# Altium schematic sheet CV060_CPU.SchDoc: CV060 HVAC Controller
size A3; Author: PPavlov; DrawnBy: PPavlov; Engineer: PPavlov; Organization: Celse; DocumentNumber: 1; Revision: 1; SheetNumber: 1; SheetTotal: 3
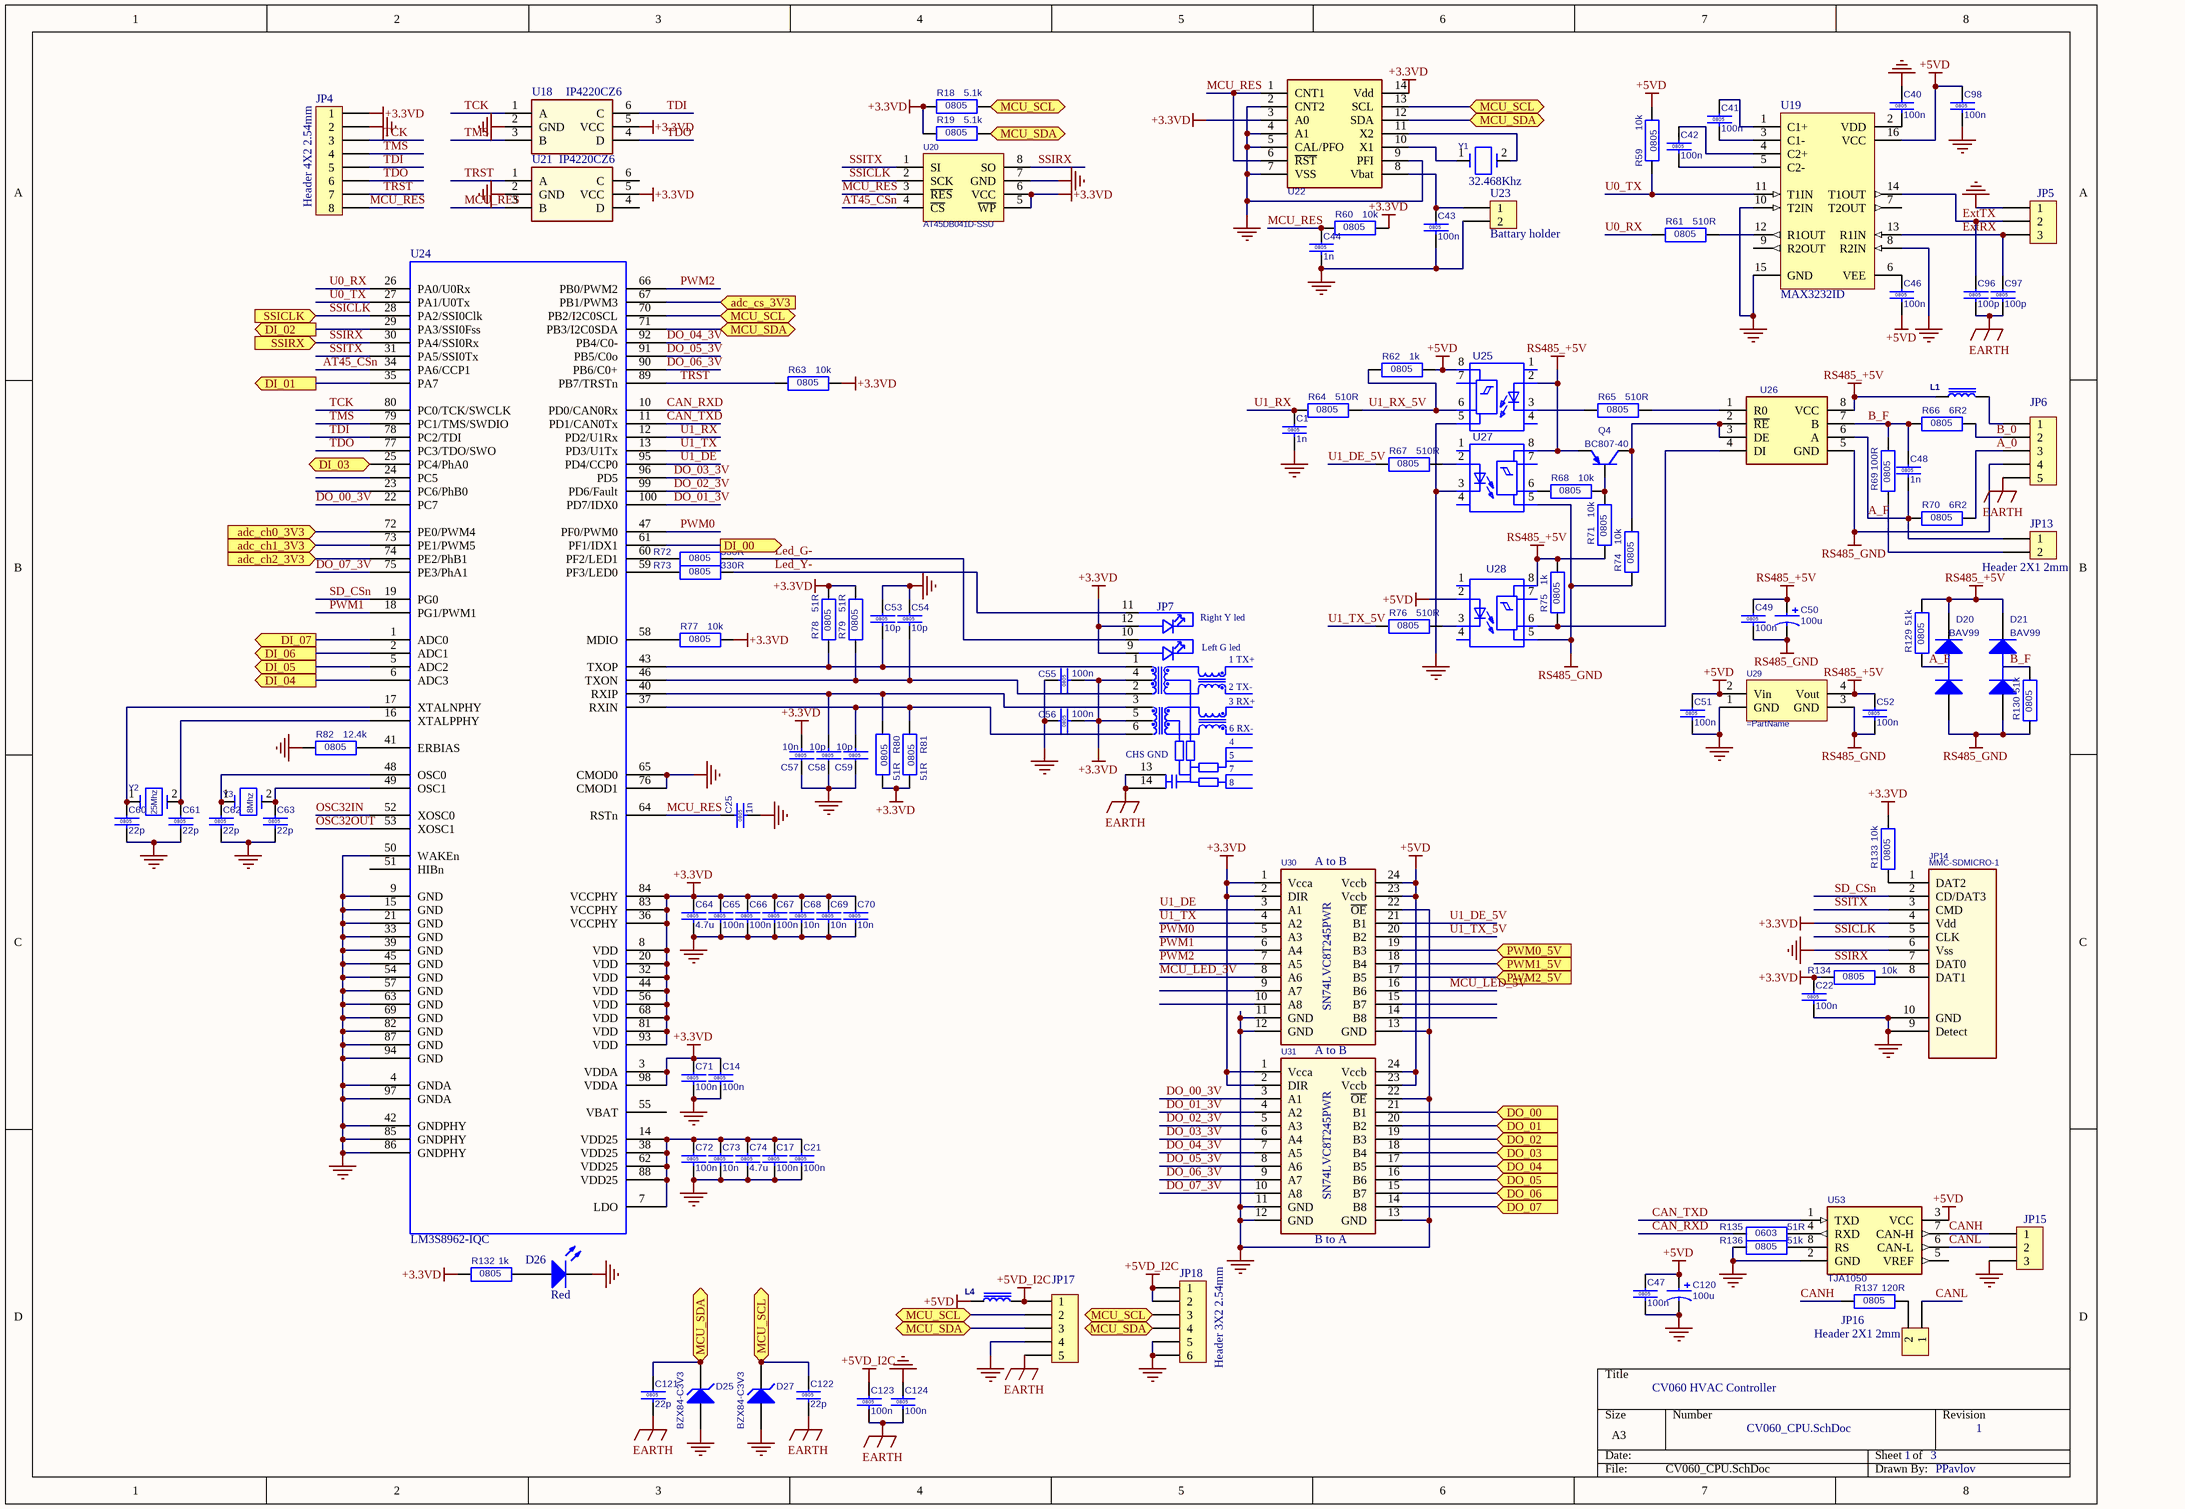
[diagram p0: CV060_CPU.SchDoc]

## Parts
C1  Case: 0805  [RC0805]  (hidden comment: 1n)
C14  Case: 0805  [RC0805]  (hidden comment: 100n)
C17  Case: 0805  [RC0805]  (hidden comment: 100n)
C21  Case: 0805  [RC0805]  (hidden comment: 100n)
C22  Case: 0805  [RC0805]  (hidden comment: 100n)
C25  Case: 0805  [RC0805]  (hidden comment: 1n)
C40  Case: 0805  [RC0805]  (hidden comment: 100n)
C41  Case: 0805  [RC0805]  (hidden comment: 100n)
C42  Case: 0805  [RC0805]  (hidden comment: 100n)
C43  Case: 0805  [RC0805]  (hidden comment: 100n)
C44  Case: 0805  [RC0805]  (hidden comment: 1n)
C46  Case: 0805  [RC0805]  (hidden comment: 100n)
C47  Case: 0805  [RC0805]  (hidden comment: 100n)
C48  Case: 0805  [RC0805]  (hidden comment: 1n)
C49  Case: 0805  [RC0805]  (hidden comment: 100n)
C50  100u  [CEH12.5D5P2.5]
C51  Case: 0805  [RC0805]  (hidden comment: 100n)
C52  Case: 0805  [RC0805]  (hidden comment: 100n)
C53  Case: 0805  [RC0805]  (hidden comment: 10p)
C54  Case: 0805  [RC0805]  (hidden comment: 10p)
C55  Case: 0805  [RC0805]  (hidden comment: 100n)
C56  Case: 0805  [RC0805]  (hidden comment: 100n)
C57  Case: 0805  [RC0805]  (hidden comment: 10n)
C58  Case: 0805  [RC0805]  (hidden comment: 10p)
C59  Case: 0805  [RC0805]  (hidden comment: 10p)
C60  Case: 0805  [RC0805]  (hidden comment: 22p)
C61  Case: 0805  [RC0805]  (hidden comment: 22p)
C62  Case: 0805  [RC0805]  (hidden comment: 22p)
C63  Case: 0805  [RC0805]  (hidden comment: 22p)
C64  Case: 0805  [RC0805]  (hidden comment: 4.7u)
C65  Case: 0805  [RC0805]  (hidden comment: 100n)
C66  Case: 0805  [RC0805]  (hidden comment: 100n)
C67  Case: 0805  [RC0805]  (hidden comment: 100n)
C68  Case: 0805  [RC0805]  (hidden comment: 10n)
C69  Case: 0805  [RC0805]  (hidden comment: 10n)
C70  Case: 0805  [RC0805]  (hidden comment: 10n)
C71  Case: 0805  [RC0805]  (hidden comment: 100n)
C72  Case: 0805  [RC0805]  (hidden comment: 100n)
C73  Case: 0805  [RC0805]  (hidden comment: 10n)
C74  Case: 0805  [RC0805]  (hidden comment: 4.7u)
C96  Case: 0805  [RC0805]  (hidden comment: 100p)
C97  Case: 0805  [RC0805]  (hidden comment: 100p)
C98  Case: 0805  [RC0805]  (hidden comment: 100n)
C120  100u  [CEH12.5D5P2.5]
C121  Case: 0805  [RC0805]  (hidden comment: 22p)
C122  Case: 0805  [RC0805]  (hidden comment: 22p)
C123  Case: 0805  [RC0805]  (hidden comment: 100n)
C124  Case: 0805  [RC0805]  (hidden comment: 100n)
D20  BAV99  [SOT23-3]
D21  BAV99  [SOT23-3]
D25  Part Number: BZX84-C3V3  [SOT23-3]  (hidden comment: Zenner_diode)
D26  RED  [LED0805]
D27  Part Number: BZX84-C3V3  [SOT23-3]  (hidden comment: Zenner_diode)
JP4  Header 4X2 2.54mm  [Pins2x4_2.54mm]
JP5  Header 3pins  [PHOENIX_3.5MM_3Pins]  (value not drawn)
JP6  Header 5pins  [PHOENIX_3.5MM_5pins]  (value not drawn)
JP7  J00-0065NL  [J00-00XXNL]  (value not drawn)
JP13  Header 2X1 2mm  [Pins2x1_2mm]
JP14  MMC-SDMICRO-1  [MMC-SDMICRO-1]
JP15  Header 3pins  [PHOENIX_3.5MM_3Pins]  (value not drawn)
JP16  Header 2X1 2mm  [Pins2x1_2mm]
JP17  Header 5pins  [PHOENIX_3.5MM_5pins]  (value not drawn)
JP18  Header 3X2 2.54mm  [Pins2x3_2.54mm]
L1  BLM31PG601SN1  [RC1206]  (value not drawn)
L4  BLM31PG601SN1  [RC1206]  (value not drawn)
Q4  Part number: BC807-40  [SOT23-3]  (hidden comment: PNP_transistor_SOT23-3)
R18  Case: 0805  [RC0805]  (hidden comment: 5.1k)
R19  Case: 0805  [RC0805]  (hidden comment: 5.1k)
R59  Case: 0805  [RC0805]  (hidden comment: 10k)
R60  Case: 0805  [RC0805]  (hidden comment: 10k)
R61  Case: 0805  [RC0805]  (hidden comment: 510R)
R62  Case: 0805  [RC0805]  (hidden comment: 1k)
R63  Case: 0805  [RC0805]  (hidden comment: 10k)
R64  Case: 0805  [RC0805]  (hidden comment: 510R)
R65  Case: 0805  [RC0805]  (hidden comment: 510R)
R66  Case: 0805  [RC0805]  (hidden comment: 6R2)
R67  Case: 0805  [RC0805]  (hidden comment: 510R)
R68  Case: 0805  [RC0805]  (hidden comment: 10k)
R69  Case: 0805  [RC0805]  (hidden comment: 100R)
R70  Case: 0805  [RC0805]  (hidden comment: 6R2)
R71  Case: 0805  [RC0805]  (hidden comment: 10k)
R72  Case: 0805  [RC0805]  (hidden comment: 330R)
R73  Case: 0805  [RC0805]  (hidden comment: 330R)
R74  Case: 0805  [RC0805]  (hidden comment: 10k)
R75  Case: 0805  [RC0805]  (hidden comment: 1k)
R76  Case: 0805  [RC0805]  (hidden comment: 510R)
R77  Case: 0805  [RC0805]  (hidden comment: 10k)
R78  Case: 0805  [RC0805]  (hidden comment: 51R)
R79  Case: 0805  [RC0805]  (hidden comment: 51R)
R80  Case: 0805  [RC0805]  (hidden comment: 51R)
R81  Case: 0805  [RC0805]  (hidden comment: 51R)
R82  Case: 0805  [RC0805]  (hidden comment: 12.4k)
R129  Case: 0805  [RC0805]  (hidden comment: 51k)
R130  Case: 0805  [RC0805]  (hidden comment: 51k)
R132  Case: 0805  [RC0805]  (hidden comment: 1k)
R133  Case: 0805  [RC0805]  (hidden comment: 10k)
R134  Case: 0805  [RC0805]  (hidden comment: 10k)
R135  Case: 0603  [RC0603]  (hidden comment: 51R)
R136  Case: 0805  [RC0805]  (hidden comment: 51k)
R137  Case: 0805  [RC0805]  (hidden comment: 120R)
U18  IP4220CZ6  [SOT-23 - 6L (R-PDSO-G6)]
U19  MAX3232ID  [SO-16]
U20  AT45DB041D-SSU  [SO-8]
U21  IP4220CZ6  [SOT-23 - 6L (R-PDSO-G6)]
U22  FM31xx  [SO-14]  (value not drawn)
U23  Battary holder  [BATTARY_HOLDER_20MM]
U24  LM3S8962-IQC  [QFP50P1600X1600X160-100N]
U25  6N137  [DIP8]  (value not drawn)
U26  SN65HVD10D  [SO-8]  (value not drawn)
U27  6N137  [DIP8]  (value not drawn)
U28  6N137  [DIP8]  (value not drawn)
U29  (no value)  [SIP4]
U30  SN74LVC8T245PWR  [TSSOP-24]
U31  SN74LVC8T245PWR  [TSSOP-24]
U53  TJA1050  [SO-8]
Y1  32.468Khz  [XTAL_32.768]
Y2  25Mhz  [CRYSTAL200]
Y3  8Mhz  [CRYSTAL200]

## Ports
adc_ch0_3V3 (in), adc_ch1_3V3 (in), adc_ch2_3V3 (in), adc_cs_3V3 (in), DI_00 (out), DI_01 (out), DI_02 (out), DI_03 (out), DI_04 (out), DI_05 (out), DI_06 (out), DI_07 (out), DO_00 (in), DO_01 (in), DO_02 (in), DO_03 (in), DO_04 (in), DO_05 (in), DO_06 (in), DO_07 (in), MCU_SCL, MCU_SDA, PWM0_5V (in), PWM1_5V (in), PWM2_5V (in), SSICLK (in), SSIRX (in)

## Nets
+3.3VD: C14.1 C22.1 C55.2 C56.2 C57.2 C64.1 C65.1 C66.1 C67.1 C68.1 C69.1 C70.1 C71.1 JP4.1 JP7.4 JP7.5 JP7.9 JP7.12 JP14.4(Vdd) R18.1 R19.1 R60.2 R63.2 R77.2 R78.2 R79.2 R80.2 R81.2 R132.1 R133.2 R134.1 U18.5(VCC) U20.5(~{WP}) U20.6(VCC) U21.5(VCC) U22.3(A0) U22.14(Vdd) U24.3(VDDA) U24.8(VDD) U24.20(VDD) U24.32(VDD) U24.36(VCCPHY) U24.44(VDD) U24.56(VDD) U24.68(VDD) U24.81(VDD) U24.83(VCCPHY) U24.84(VCCPHY) U24.93(VDD) U24.98(VDDA) U30.1(Vcca) U30.2(DIR) U31.1(Vcca) U31.2(DIR)
+5VD: C46.2 C47.1 C51.1 C98.1 C120.1 L4.1 R59.1 R62.2 U19.16(VCC) U25.8 U28.2 U29.2(Vin) U30.23(Vccb) U30.24(Vccb) U31.23(Vccb) U31.24(Vccb) U53.3(VCC)
+5VD_I2C: C123.1 JP17.1 JP18.1 JP18.2 L4.2
DGND: C1.2 C14.2 C17.2 C21.2 C22.2 C25.2 C40.1 C43.2 C44.2 C47.2 C51.2 C53.1 C54.1 C55.1 C56.1 C57.1 C58.1 C59.1 C60.2 C61.2 C62.2 C63.2 C64.2 C65.2 C66.2 C67.2 C68.2 C69.2 C70.2 C71.2 C72.2 C73.2 C74.2 C98.2 C120.2 C124.1 D25.2(A) D26.1(K) D27.2(A) JP4.2 JP5.1 JP14.6(Vss) JP14.9(Detect) JP14.10(GND) JP14.11(GND) JP14.12(GND) JP14.13(GND) JP15.3 JP17.4 JP18.5 JP18.6 R82.1 R136.1 U18.2(GND) U19.8(R2IN) U19.10(T2IN) U19.15(GND) U20.7(GND) U21.2(GND) U22.2(CNT2) U22.4(A1) U22.5(CAL/PFO) U22.7(VSS) U22.9(PFI) U23.2 U24.4(GNDA) U24.9(GND) U24.15(GND) U24.21(GND) U24.33(GND) U24.39(GND) U24.42(GNDPHY) U24.45(GND) U24.50(WAKEn) U24.54(GND) U24.57(GND) U24.63(GND) U24.65(CMOD0) U24.69(GND) U24.76(CMOD1) U24.82(GND) U24.85(GNDPHY) U24.86(GNDPHY) U24.87(GND) U24.94(GND) U24.97(GNDA) U25.5 U27.3 U29.1(GND) U30.11(GND) U30.12(GND) U30.13(GND) U30.22(~{OE}) U31.11(GND) U31.12(GND) U31.13(GND) U31.22(~{OE}) U53.2(GND)
EARTH: C96.2 C97.2 C121.2 C122.2 C123.2 C124.2 JP6.5 JP7.13 JP7.14 JP17.5
RS485_+5V: C49.1 C50.1 C52.1 D20.2(K) D21.2(K) L1.1 Q4.2(E) R71.1 R75.2 R129.2 U25.2 U26.8(VCC) U27.8 U28.8 U29.4(Vout)
RS485_GND: C49.2 C50.2 C52.2 D20.1(A) D21.1(A) JP6.4 R74.1 R130.1 U26.5(GND) U27.5 U28.5 U29.3(GND)
A_0: JP6.3 R70.2
A_F: C48.2 D20.3(C) JP13.1 R70.1 R129.1 U26.6(A)
adc_ch0_3V3: U24.72(PE0/PWM4) ; port adc_ch0_3V3
adc_ch1_3V3: U24.73(PE1/PWM5) ; port adc_ch1_3V3
adc_ch2_3V3: U24.74(PE2/PhB1) ; port adc_ch2_3V3
adc_cs_3V3: U24.67(PB1/PWM3) ; port adc_cs_3V3
AT45_CSn: U20.4(~{CS}) U24.34(PA6/CCP1)
B_0: JP6.2 R66.2
B_F: C48.1 D21.3(C) R66.1 R69.2 R130.2 U26.7(B)
CAN_RXD: R135.1 U24.10(PD0/CAN0Rx)
CAN_TXD: U24.11(PD1/CAN0Tx) U53.1(TXD)
CANH: JP15.1 R137.1 U53.7(CAN-H)
CANL: JP15.2 JP16.1 U53.6(CAN-L)
DI_00: U24.61(PF1/IDX1) ; port DI_00
DI_01: U24.35(PA7) ; port DI_01
DI_02: U24.29(PA3/SSI0Fss) ; port DI_02
DI_03: U24.25(PC4/PhA0) ; port DI_03
DI_04: U24.6(ADC3) ; port DI_04
DI_05: U24.5(ADC2) ; port DI_05
DI_06: U24.2(ADC1) ; port DI_06
DI_07: U24.1(ADC0) ; port DI_07
DO_00: U31.21(B1) ; port DO_00
DO_00_3V: U24.22(PC7) U31.3(A1)
DO_01: U31.20(B2) ; port DO_01
DO_01_3V: U24.100(PD7/IDX0) U31.4(A2)
DO_02: U31.19(B3) ; port DO_02
DO_02_3V: U24.99(PD6/Fault) U31.5(A3)
DO_03: U31.18(B4) ; port DO_03
DO_03_3V: U24.96(PD5) U31.6(A4)
DO_04: U31.17(B5) ; port DO_04
DO_04_3V: U24.92(PB4/C0-) U31.7(A5)
DO_05: U31.16(B6) ; port DO_05
DO_05_3V: U24.91(PB5/C0o) U31.8(A6)
DO_06: U31.15(B7) ; port DO_06
DO_06_3V: U24.90(PB6/C0+) U31.9(A7)
DO_07: U31.14(B8) ; port DO_07
DO_07_3V: U24.75(PE3/PhA1) U31.10(A8)
ExtRX: C97.1 JP5.3 U19.13(R1IN)
ExtTX: C96.1 JP5.2 U19.14(T1OUT)
Led_G-: JP7.10 R72.2
Led_Y-: JP7.11 R73.2
MCU_LED_3V: U30.8(A6)
MCU_LED_5V: U30.16(B6)
MCU_RES: C25.1 C44.1 JP4.8 R60.1 U20.3(~{RES}) U21.3(B) U22.1(CNT1) U22.6(~{RST}) U24.64(RSTn)
MCU_SCL: C122.1 D27.1(K) JP17.2 JP18.3 R18.2 U22.13(SCL) U24.70(PB2/I2C0SCL) ; port MCU_SCL
MCU_SDA: C121.1 D25.1(K) JP17.3 JP18.4 R19.2 U22.12(SDA) U24.71(PB3/I2C0SDA) ; port MCU_SDA
OSC32IN: U24.52(XOSC0)
OSC32OUT: U24.53(XOSC1)
PWM0: U24.47(PF0/PWM0) U30.5(A3)
PWM0_5V: U30.19(B3) ; port PWM0_5V
PWM1: U24.18(PG1/PWM1) U30.6(A4)
PWM1_5V: U30.18(B4) ; port PWM1_5V
PWM2: U24.66(PB0/PWM2) U30.7(A5)
PWM2_5V: U30.17(B5) ; port PWM2_5V
SD_CSn: JP14.2(CD/DAT3) U24.19(PG0)
SSICLK: JP14.5(CLK) U20.2(SCK) U24.28(PA2/SSI0Clk) ; port SSICLK
SSIRX: JP14.7(DAT0) U20.8(SO) U24.30(PA4/SSI0Rx) ; port SSIRX
SSITX: JP14.3(CMD) U20.1(SI) U24.31(PA5/SSI0Tx)
TCK: JP4.3 U18.1(A) U24.80(PC0/TCK/SWCLK)
TDI: JP4.5 U18.6(C) U24.78(PC2/TDI)
TDO: JP4.6 U18.4(D) U24.77(PC3/TDO/SWO)
TMS: JP4.4 U18.3(B) U24.79(PC1/TMS/SWDIO)
TRST: JP4.7 R63.1 U21.1(A) U24.89(PB7/TRSTn)
U0_RX: R61.1 U24.26(PA0/U0Rx)
U0_TX: R59.2 U19.11(T1IN) U24.27(PA1/U0Tx)
U1_DE: U24.95(PD4/CCP0) U30.3(A1)
U1_DE_5V: R67.1 U30.21(B1)
U1_RX: C1.1 R64.1 U24.12(PD2/U1Rx)
U1_RX_5V: R62.1 R64.2 U25.6
U1_TX: U24.13(PD3/U1Tx) U30.4(A2)
U1_TX_5V: R76.1 U30.20(B2)
NetC17_1: C17.1 C21.1 C72.1 C73.1 C74.1 U24.7(LDO) U24.14(VDD25) U24.38(VDD25) U24.62(VDD25) U24.88(VDD25)
NetC40_2: C40.2 U19.2(VDD)
NetC41_1: C41.1 U19.1(C1+)
NetC41_2: C41.2 U19.3(C1-)
NetC42_1: C42.1 U19.4(C2+)
NetC42_2: C42.2 U19.5(C2-)
NetC43_1: C43.1 U22.8(Vbat) U23.1
NetC46_1: C46.1 U19.6(VEE)
NetC53_2: C53.2 JP7.1 R78.1 U24.43(TXOP)
NetC54_2: C54.2 JP7.2 R79.1 U24.46(TXON)
NetC58_2: C58.2 JP7.3 R80.1 U24.40(RXIP)
NetC59_2: C59.2 JP7.6 R81.1 U24.37(RXIN)
NetC60_1: C60.1 U24.17(XTALNPHY) Y2.1
NetC61_1: C61.1 U24.16(XTALPPHY) Y2.2
NetC62_1: C62.1 U24.48(OSC0) Y3.1
NetC63_1: C63.1 U24.49(OSC1) Y3.2
NetD26_2: D26.2(A) R132.2
NetJP6_1: JP6.1 L1.2
NetJP13_2: JP13.2 R69.1
NetJP14_1: JP14.1(DAT2) R133.1
NetJP14_8: JP14.8(DAT1) R134.2
NetJP16_2: JP16.2 R137.2
NetQ4_1: Q4.1(B) R68.2 R71.2
NetQ4_3: Q4.3(C) R74.2 U26.2(~{RE}) U26.3(DE)
NetR61_2: R61.2 U19.12(R1OUT)
NetR65_1: R65.1 U25.3
NetR65_2: R65.2 U26.1(R0)
NetR67_2: R67.2 U27.2
NetR68_1: R68.1 U27.6
NetR72_1: R72.1 U24.60(PF2/LED1)
NetR73_1: R73.1 U24.59(PF3/LED0)
NetR75_1: R75.1 U26.4(DI) U28.6
NetR76_2: R76.2 U28.3
NetR77_1: R77.1 U24.58(MDIO)
NetR82_2: R82.2 U24.41(ERBIAS)
NetR135_2: R135.2 U53.4(RXD)
NetR136_2: R136.2 U53.8(RS)
NetU22_10: U22.10(X1) Y1.1
NetU22_11: U22.11(X2) Y1.2

Not connected (* = marked no-connect by the designer): U19 7(T2OUT) 9(R2OUT); U21 4(D) 6(C); U24 23(PC6/PhB0) 24(PC5) 51(HIBn) 55(VBAT); U25 1 4 7; U27 1 4 7; U28 1 4 7; U30 9(A7) 10(A8) 14(B8) 15(B7); U53 5(VREF)

## Notes on the sheet
- (near U30) A to B
- A to B
- (near U31) B to A
- (in symbol J00-0065NL) Right Y led; Left G led; 1 TX+; 2 TX-; 3 RX+; 6 RX-; CHS GND; 7; 8

## Library data of the parts
C1 C25 C44 C48 = CC0805K-X5R-50V0-1N00: Chip capacitor, 20p; Manufacturer: KEMET, YAGEO; Voltage: 50V; Tolerance: 10%; ROSH: Yes; Material: X5R; Package: 7" paper reel; Part number: CC0805K-X5R-50V0-1N00; Suppliers: Avnet; Temperature: -55 - +125 C; Value: 1n; Supplier: Avnet-Abacus; Pb Free: Yes; Component Type: Standard; ComponentLink1Description: Manufacturer Link; ComponentLink2Description: Datasheet; ComponentLink2URL: http://www.yageo.com/pdf/UPY-GPHC_X5R_6.3V-to-50V_3.pdf; Published: 05.04.2010; Publisher: ppavlov
C14 C17 C21 C22 C40-C43 C46 C47 C49 C51 C52 C55 C56 C65-C67 C71 C72 C98 C123 C124 = CC0805K-X5R-50V0-100N: Chip capacitor, 20p; Manufacturer: KEMET, YAGEO; Voltage: 50V; Tolerance: 10%; ROSH: Yes; Material: X5R; Package: 7" paper reel; Part number: CC0805K-X5R-50V0-100N; Suppliers: Avnet; Temperature: -55 - +125 C; Value: 100n; Supplier: Avnet-Abacus; Pb Free: Yes; Component Type: Standard; ComponentLink1Description: Manufacturer Link; ComponentLink2Description: Datasheet; ComponentLink2URL: http://www.yageo.com/pdf/UPY-GPHC_X5R_6.3V-to-50V_3.pdf; Published: 05.04.2010; Publisher: ppavlov
C50 C120 = CEH12.5D5P2.5M-16V-100U: Electrolytic capacitor; Manufacturer: Panasonic; Manufacturer Part Number: C H12.5D5P2.5M-16V-100U; Voltage: 16V; Tolerance: 20%; Pb Free: Yes; Case: 12.5x5x2.5; Value: 100u; Part Number: CEH12.5D5P2.5M-16V-100U; Temperature: -55 - +105 C; Supplier: Megasan; MOQ: 500; Component Type: Standard; ComponentLink1Description: Manufacturer Link; ComponentLink2Description: Datasheet; ComponentLink2URL: http://industrial.panasonic.com/www-data/pdf/ABA0000/ABA0000CE22.pdf; Published: 11.12.2009; Publisher: ppavlov
C53 C54 C58 C59 = CC0805K-X5R-50V0-10P0: Chip capacitor, 20p; Manufacturer: KEMET, YAGEO; Voltage: 50V; Tolerance: 10%; ROSH: Yes; Material: X5R; Package: 7" paper reel; Part number: CC0805K-X5R-50V0-10P0; Suppliers: Avnet; Temperature: -55 - +125 C; Value: 10p; Supplier: Avnet-Abacus; Pb Free: Yes; Component Type: Standard; ComponentLink1Description: Manufacturer Link; ComponentLink2Description: Datasheet; ComponentLink2URL: http://www.yageo.com/pdf/UPY-GPHC_X5R_6.3V-to-50V_3.pdf; Published: 05.04.2010; Publisher: ppavlov
C57 C68-C70 C73 = CC0805K-X5R-50V0-10N0: Chip capacitor, 20p; Manufacturer: KEMET, YAGEO; Voltage: 50V; Tolerance: 10%; ROSH: Yes; Material: X5R; Package: 7" paper reel; Part number: CC0805K-X5R-50V0-10N0; Suppliers: Avnet; Temperature: -55 - +125 C; Value: 10n; Supplier: Avnet-Abacus; Pb Free: Yes; Component Type: Standard; ComponentLink1Description: Manufacturer Link; ComponentLink2Description: Datasheet; ComponentLink2URL: http://www.yageo.com/pdf/UPY-GPHC_X5R_6.3V-to-50V_3.pdf; Published: 05.04.2010; Publisher: ppavlov
C60-C63 C121 C122 = CC0805K-NP0-50V0-22P0: Chip capacitor, 20p; Manufacturer: SAMSUNG, VISHAY, YAGEO; Voltage: 50V; Tolerance: 10%; ROSH: Yes; Material: NP0; Package: 7" paper reel; Part number: CC0805K-NP0-50V0-22P0; Suppliers: Avnet; Temperature: -55 - +125 C; Value: 22p; Supplier: Megasan; Pb Free: Yes; Component Type: Standard; ComponentLink1Description: Manufacturer Link; ComponentLink2Description: Datasheet; ComponentLink2URL: http://www.yageo.com/pdf/UPY-GP_NP0_16V-to-50V_2.pdf; Published: 18.08.2010; Publisher: ppavlov
C64 C74 = CC0805K-X7R-16V0-4U70: Chip capacitor, 20p; Manufacturer: KEMET, YAGEO; Voltage: 16V; Tolerance: 10%; ROSH: Yes; Material: X7R; Package: 7" paper reel; Part number: CC0805K-X7R-16V0-4U70; Suppliers: Avnet; Temperature: -55 - +125 C; Value: 4.7u; Supplier: Avnet-Abacus; Pb Free: Yes; Component Type: Standard; ComponentLink1Description: Manufacturer Link; ComponentLink2Description: Datasheet; ComponentLink2URL: http://www.yageo.com/pdf/UPY-GPHC_X7R_6.3V-to-50V_3.pdf; Published: 11.11.2009; Publisher: tkondratyuk
C96 C97 = CC0805K-X5R-50V0-100P: Chip capacitor, 20p; Manufacturer: KEMET, YAGEO; Voltage: 50V; Tolerance: 10%; ROSH: Yes; Material: X5R; Package: 7" paper reel; Part number: CC0805K-X5R-50V0-100P; Suppliers: Avnet; Temperature: -55 - +125 C; Value: 100p; Supplier: Avnet-Abacus; Pb Free: Yes; Component Type: Standard; ComponentLink1Description: Manufacturer Link; ComponentLink2Description: Datasheet; ComponentLink2URL: http://www.yageo.com/pdf/UPY-GPHC_X5R_6.3V-to-50V_3.pdf; Published: 05.04.2010; Publisher: ppavlov
D20 D21 = BAV99: Dual small signal diode; Manufacturer: Fairchild; Forward current: 0.2A; Breakdown Voltage: 70V; Pb Free: Yes; Stock ID: D040; Temperature: -55 - +150 C; Supplier: EBV; Manufacturer Part Number: BAV99; Component Type: Standard; ComponentLink1Description: Manufacturer Link; Case: SOT23-3; ComponentLink2Description: Datasheet; ComponentLink2URL: http://www.fairchildsemi.com/ds/BA%2FBAV99.pdf; Published: 16.11.2009; Publisher: tkondratyuk; Part Number: BAV99; Current: 0.2A; Voltage: 70V
D25 D27 = BZX84-C3V3: Transient Voltage Suppressor; Manufacturer: Fairchild; Manufacturer Part Number: BZX84C3V3; Current: 5ma; Voltage: 3.3V; Pb Free: Yes; Temperature: -55 - +150 C; Supplier: EBV; Component Type: Standard; ComponentLink1Description: Manufacturer Link; Case: SOT23-3; ComponentLink2Description: Datasheet; ComponentLink2URL: http://www.fairchildsemi.com/pf/BZ/BZX84C3V3.html; Published: 06.04.2011; Publisher: ppavlov
D26 = HSMC-C170: High Performance ChipLED / 0805; Manufacturer: Avago; Current: 20mA; Voltage: 1.9V; Color: Red; Part Number: HSMC-C170; Stock ID: D015; Temperature: -30 - +85 C; Supplier: EBV; Manufacturer Part Number: HSMC-C170; Component Type: Standard; ComponentLink1Description: Manufacturer Link; Case: LED0805; ComponentLink2Description: Datasheet; ComponentLink2URL: http://www.avagotech.com/docs/AV02-0112EN; Published: 18.11.2009; Publisher: tkondratyuk
JP4 = Header 4X2 2.54mm: Pins number: 8; Pb Free: Yes; Part Number: Header 4X2 2.54mm; Temperature: -40 - +105 C; Component Type: Standard; ComponentLink1Description: Manufacturer Link; Case: Pins2x4_2.54mm; ComponentLink2Description: Datasheet; Published: 05.01.2010; Publisher: ppavlov
JP5 JP15 = ETB87032J000: 3.5mm angled 3pins receptabe; Pins number: 3; Pb Free: Yes; Part Number: ETB87032J000; Temperature: -40 - +105 C; Manufacturer Part Number: ETB87032J000; Component Type: Standard; ComponentLink1Description: Manufacturer Link; Case: PHOENIX_3.5MM_3Pins; ComponentLink2Description: Datasheet; Published: 04.01.2010; Publisher: ppavlov
JP6 JP17 = ETB87052J000: 3.5mm angled 5pins receptabe; Pins number: 4; Pb Free: Yes; Part Number: ETB87052J000; Temperature: -40 - +105 C; Manufacturer Part Number: ETB87052J000; Component Type: Standard; ComponentLink1Description: Manufacturer Link; Case: PHOENIX_3.5MM_5pins; ComponentLink2Description: Datasheet; Published: 04.01.2010; Publisher: ppavlov
JP7 = J00-0065NL: RJ45+coils ethernet connector; Manufacturer: Pulse; Pins number: 12; Pb Free: Yes; Part Number: J00-0065NL; Temperature: -40 - +105 C; Supplier: microchip.ua; Manufacturer Part Number: J00-0065NL; Component Type: Standard; ComponentLink1Description: http://productfinder.pulseeng.com/product/J00-0065NL; Case: J00-00XXNL; ComponentLink2Description: Datasheet; ComponentLink2URL: www.pulseeng.com; Published: 04.01.2010; Publisher: ppavlov
JP13 JP16 = Header 2X1 2mm: Pins number: 2; Pb Free: Yes; Part Number: Header 2X1 2mm; Temperature: -40 - +105 C; Component Type: Standard; ComponentLink1Description: Manufacturer Link; Case: Pins2x1_2mm; ComponentLink2Description: Datasheet; Published: 05.01.2010; Publisher: ppavlov
JP14 = MMC-SDMICRO-1: Micro SD card holder, vertical; Manufacturer: Attend technology INC; Pins number: 8; Pb Free: Yes; Part Number: MMC-SDMICRO-1; Temperature: -40 - +105 C; Manufacturer Part Number: MMC-SDMICRO-1; Component Type: Standard; ComponentLink1Description: Manufacturer Link; Case: MMC-SDMICRO-1; ComponentLink2Description: Datasheet; Published: 02.02.2011; Publisher: ppavlov
JP18 = Header 3X2 2.54mm: Pins number: 6; Pb Free: Yes; Part Number: Header 3X2 2.54mm; Temperature: -40 - +105 C; Component Type: Standard; ComponentLink1Description: Manufacturer Link; Case: Pins2x3_2.54mm; ComponentLink2Description: Datasheet; Published: 29.06.2010; Publisher: ppavlov
L1 L4 = BLM31PG601SN1: Ferrite bead smd; Manufacturer: Murata; ID: BLM31A260S; Tolerance: 25%; Type: Inductivity; Resistance: 600; Rated current: 1,5A; Pb Free: Yes; Package: 1206; Note: BLM31A260S; Author: PPavlov; Part Number: BLM31PG601SN1; Temperature: -55 - +125 C; Manufacturer Part Number: BLM31PG601SN1; Component Type: Standard; Case: RC1206; ComponentLink2Description: Datasheet; ComponentLink2URL: http://www.murata.com/; Published: 05.01.2010; Publisher: ppavlov
Q4 = BC807-40: General Purpose  PNP Transistor; Manufacturer: ONS, NXP; Manufacturer Part Number: BC807?40LT1G; Analogs: MMBT2907A; Current: 0.5A; Voltage CEO: -45V; Pb Free: Yes; Stock ID: Q010; Temperature: -55 - +150 C; Supplier: EBV; MOQ: 3000; Package: Tape and Reel; Component Type: Standard; ComponentLink1Description: Manufacturer Link; Case: SOT23-3; ComponentLink2Description: Datasheet; ComponentLink2URL: http://www.onsemi.com/pub/Collateral/BC807-16LT1-D.PDF; Published: 16.11.2009; Publisher: tkondratyuk
R18 R19 = RC0805F-5K10: Chip resistor; Manufacturer: PHILIPS, SAMSUNG; Voltage: 200V; Power: 1/10W; Tolerance: 1%; Pb Free: Yes; Value: 5.1k; Part Number: RC0805F-5K10; Temperature: -55 - +155 C; Supplier: Megasan; Component Type: Standard; ComponentLink1Description: Manufacturer Link; ComponentLink2Description: Datasheet; ComponentLink2URL: http://www.yageo.com/pdf/PYu-RC1206_51_RoHS_L_4.pdf; Published: 11.12.2009; Publisher: ppavlov
R59 R60 R63 R68 R71 R74 R77 R133 R134 = RC0805F-10K0: Chip resistor; Manufacturer: PHILIPS, SAMSUNG; Voltage: 200V; Power: 1/10W; Tolerance: 1%; Pb Free: Yes; Value: 10k; Part Number: RC0805F-10K0; Temperature: -55 - +155 C; Supplier: Megasan; Component Type: Standard; ComponentLink1Description: Manufacturer Link; ComponentLink2Description: Datasheet; ComponentLink2URL: http://www.yageo.com/pdf/PYu-RC1206_51_RoHS_L_4.pdf; Published: 11.12.2009; Publisher: ppavlov
R61 R64 R65 R67 R76 = RC0805F-510R: Chip resistor; Manufacturer: PHILIPS, SAMSUNG; Voltage: 200V; Power: 1/10W; Tolerance: 1%; Pb Free: Yes; Value: 510R; Part Number: RC0805F-510R; Temperature: -55 - +155 C; Supplier: Megasan; Component Type: Standard; ComponentLink1Description: Manufacturer Link; ComponentLink2Description: Datasheet; ComponentLink2URL: http://www.yageo.com/pdf/PYu-RC1206_51_RoHS_L_4.pdf; Published: 11.12.2009; Publisher: ppavlov
R62 R75 R132 = RC0805F-1K00: Chip resistor; Manufacturer: PHILIPS, SAMSUNG; Voltage: 200V; Power: 1/10W; Tolerance: 1%; Pb Free: Yes; Value: 1k; Part Number: RC0805F-1K00; Temperature: -55 - +155 C; Supplier: Megasan; Component Type: Standard; ComponentLink1Description: Manufacturer Link; ComponentLink2Description: Datasheet; ComponentLink2URL: http://www.yageo.com/pdf/PYu-RC1206_51_RoHS_L_4.pdf; Published: 11.12.2009; Publisher: ppavlov
R66 R70 = RC0805F-6R20: Chip resistor; Manufacturer: PHILIPS, SAMSUNG; Voltage: 200V; Power: 1/10W; Tolerance: 1%; Pb Free: Yes; Value: 6R2; Part Number: RC0805F-6R20; Temperature: -55 - +155 C; Supplier: Megasan; Component Type: Standard; ComponentLink1Description: Manufacturer Link; ComponentLink2Description: Datasheet; ComponentLink2URL: http://www.yageo.com/pdf/PYu-RC1206_51_RoHS_L_4.pdf; Published: 11.12.2009; Publisher: ppavlov
R69 = RC0805F-100R: Chip resistor; Manufacturer: PHILIPS, SAMSUNG; Voltage: 200V; Power: 1/10W; Tolerance: 1%; Pb Free: Yes; Value: 100R; Part Number: RC0805F-100R; Temperature: -55 - +155 C; Supplier: Megasan; Component Type: Standard; ComponentLink1Description: Manufacturer Link; ComponentLink2Description: Datasheet; ComponentLink2URL: http://www.yageo.com/pdf/PYu-RC1206_51_RoHS_L_4.pdf; Published: 11.12.2009; Publisher: ppavlov
R72 R73 = RC0805F-330R: Chip resistor; Manufacturer: PHILIPS, SAMSUNG; Voltage: 200V; Power: 1/10W; Tolerance: 1%; Pb Free: Yes; Value: 330R; Part Number: RC0805F-330R; Temperature: -55 - +155 C; Supplier: Megasan; Component Type: Standard; ComponentLink1Description: Manufacturer Link; ComponentLink2Description: Datasheet; ComponentLink2URL: http://www.yageo.com/pdf/PYu-RC1206_51_RoHS_L_4.pdf; Published: 11.12.2009; Publisher: ppavlov
R78-R81 = RC0805F-51R0: Chip resistor; Manufacturer: PHILIPS, SAMSUNG; Voltage: 200V; Power: 1/10W; Tolerance: 1%; Pb Free: Yes; Value: 51R; Part Number: RC0805F-51R0; Temperature: -55 - +155 C; Supplier: Megasan; Component Type: Standard; ComponentLink1Description: Manufacturer Link; ComponentLink2Description: Datasheet; ComponentLink2URL: http://www.yageo.com/pdf/PYu-RC1206_51_RoHS_L_4.pdf; Published: 11.12.2009; Publisher: ppavlov
R82 = RC0805F-12K4: Chip resistor; Manufacturer: PHILIPS, SAMSUNG; Voltage: 50V; Power: 1/10W; Tolerance: 1%; Pb Free: Yes; Value: 12.4k; Part Number: RC0805F-12K4; Temperature: -55 - +155 C; Supplier: Megasan; Component Type: Standard; ComponentLink1Description: Manufacturer Link; ComponentLink2Description: Datasheet; ComponentLink2URL: http://www.yageo.com/pdf/PYu-RC0603_51_RoHS_L_4.pdf; Published: 07.01.2010; Publisher: ppavlov
R129 R130 R136 = RC0805F-51K0: Chip resistor; Manufacturer: PHILIPS, SAMSUNG; Voltage: 200V; Power: 1/10W; Tolerance: 1%; Pb Free: Yes; Value: 51k; Part Number: RC0805F-51K0; Temperature: -55 - +155 C; Supplier: Megasan; Component Type: Standard; ComponentLink1Description: Manufacturer Link; ComponentLink2Description: Datasheet; ComponentLink2URL: http://www.yageo.com/pdf/PYu-RC1206_51_RoHS_L_4.pdf; Published: 11.12.2009; Publisher: ppavlov
R135 = RC0603F-51R0: Chip resistor; Manufacturer: PHILIPS, SAMSUNG; Voltage: 50V; Power: 1/10W; Tolerance: 1%; Pb Free: Yes; Value: 51R; Part Number: RC0603F-51R0; Temperature: -55 - +155 C; Supplier: Megasan; Component Type: Standard; ComponentLink1Description: Manufacturer Link; ComponentLink2Description: Datasheet; ComponentLink2URL: http://www.yageo.com/pdf/PYu-RC0603_51_RoHS_L_4.pdf; Published: 11.12.2009; Publisher: ppavlov
R137 = RC0805F-120R: Chip resistor; Manufacturer: PHILIPS, SAMSUNG; Voltage: 200V; Power: 1/10W; Tolerance: 1%; Pb Free: Yes; Value: 120R; Part Number: RC0805F-120R; Temperature: -55 - +155 C; Supplier: Megasan; Component Type: Standard; ComponentLink1Description: Manufacturer Link; ComponentLink2Description: Datasheet; ComponentLink2URL: http://www.yageo.com/pdf/PYu-RC1206_51_RoHS_L_4.pdf; Published: 11.12.2009; Publisher: ppavlov
U18 U21 = IP4220CZ6: Dual USB 2.0 integrated ESD protection; Manufacturer: NXP; Voltage: 5V; Pb Free: Yes; Part Number: IP4220CZ6; Temperature: -60 - +150 C; Supplier: EBV; Component Type: Standard; ComponentLink1Description: Manufacturer Link; Case: SOT457; ComponentLink2Description: Datasheet; ComponentLink2URL: http://www.nxp.com/#/pip/pip=[pip=IP4220CZ6_4]; Published: 02.02.2010; Publisher: ppavlov
U19 = MAX3232ID: +3.3V Powered, Multi-Channel RS-232 Driver/Receiver; Manufacturer: TI; Pb Free: Yes; Revision: 17-Jul-2002: Re-released for DXP Platform.; Part Number: MAX3232ID; Temperature: -40 - +85 C; Supplier: EBV; Manufacturer Part Number: MAX3232ID; MOQ: 40; Component Type: Standard; ComponentLink1Description: Manufacturer Link; Case: SO-16; ComponentLink2Description: Datasheet; ComponentLink2URL: http://focus.ti.com/docs/prod/folders/print/max3232.html; Published: 06.01.2010; Publisher: ppavlov
U20 = AT45DB041D-SSU: 4-megabit 2.5-volt or 2.7-volt DataFlash®; Manufacturer: Atmel; Pb Free: Yes; Part Number: AT45DB041D-SSU; Temperature: –40°C to +85°C; Manufacturer Part Number: AT45DB041D-SSU; Component Type: Standard; ComponentLink1Description: Manufacturer Link; Case: SO-8; ComponentLink2Description: Datasheet; Published: 29.06.2010; Publisher: ppavlov
U22 = FM3104-G: Microprocessor / Supervisory Circuits / ADM705/ADM706/ADM707/ADM7; Manufacturer: Ramtron; Pb Free: Yes; Part Number: FM3104-G; Temperature: -40 - +85 C; Manufacturer Part Number: FM3104-G; Component Type: Standard; ComponentLink1Description: Manufacturer Link; Case: SO-14; ComponentLink2Description: Datasheet; Published: 18.08.2010; Publisher: ppavlov
U23 = Battary holder: Pins number: 2; Pb Free: Yes; Part Number: Battary holder; Temperature: -40 - +105 C; Component Type: Standard; ComponentLink1Description: Manufacturer Link; Case: BATTARY_HOLDER_20MM; ComponentLink2Description: Datasheet; Published: 04.01.2010; Publisher: ppavlov
U24 = LM3S8962-IQC: ARM Cortex-M3 Microcontroller; Manufacturer: TI; Pb Free: Yes; Part Number: LM3S8962-IQC; Temperature: -40 +85 C; Manufacturer Part Number: LM3S8962-IQC; Component Type: Standard; ComponentLink1Description: Manufacturer Link; Case: QFP50P1600X1600X160-100N; ComponentLink2Description: Datasheet; Published: 12.01.2011; Publisher: ppavlov
U25 U27 U28 = 6N137: High CMR, High Speed TTL / Compatible Optocouplers; Value: *; Part Number: 6N137; Manufacturer Part Number: 6N137; Component Type: Standard; ComponentLink1Description: Manufacturer Link; Case: DIP8; ComponentLink2Description: Datasheet; Published: 06.04.2010; Publisher: ppavlov
U26 = SN65HVD10D: RS-485 Transceiver; Manufacturer: TI; Pb Free: Yes; Part Number: SN65HVD10D; Temperature: -40 - +85 C; Supplier: EBV; Manufacturer Part Number: SN65HVD10D; Component Type: Standard; ComponentLink1Description: Manufacturer Link; Case: SO-8; ComponentLink2Description: Datasheet; ComponentLink2URL: http://focus.ti.com/docs/prod/folders/print/sn65hvd11.html; Published: 11.06.2010; Publisher: ppavlov
U29 = 1-05-05S: 1W Insulated DCDC converter; Manufacturer: TI; Manufacturer Part Number: E101E; Pb Free: Yes; Part Number: 1-05-05S; Temperature: -40 - +85 C; Component Type: Standard; ComponentLink1Description: Manufacturer Link; Case: SIP4; ComponentLink2Description: Datasheet; Published: 07.01.2010; Publisher: ppavlov
U30 U31 = SN74LVC8T245PWR: 8-Bit Dual-Supply Bus Transceiver with Configurable Voltage Translation and 3-State Outputs; Manufacturer: TI; Pb Free: Yes; Author: PPavlov; Part Number: SN74LVC8T245PWR; Temperature: -40 - +85 C; Supplier: EBV; Manufacturer Part Number: SN74LVC8T245PWR; Component Type: Standard; ComponentLink1Description: Manufacturer Link; Case: TSSOP-24; ComponentLink2Description: Datasheet; ComponentLink2URL: http://focus.ti.com/docs/prod/folders/print/sn74lvc8t245.html; Published: 05.07.2010; Publisher: ppavlov
U53 = TJA1050: High speed CAN transceiver; Manufacturer: Philips; Pb Free: Yes; Part Number: TJA1050; Temperature: -40 - +85 C; Manufacturer Part Number: TJA1050; MOQ: 2500; Component Type: Standard; ComponentLink1Description: Manufacturer Link; Case: SO-8; ComponentLink2Description: Datasheet; Published: 06.04.2011; Publisher: ppavlov
Y1 = Crystall_32.468Khz: Clock Xtal through hole; Frequency stability: 50 ppm; Pb Free: Yes; Value: 32.468Khz; Part Number: Crystall_32.468Khz; Temperature: -20 - +70 C; Component Type: Standard; ComponentLink1Description: Manufacturer Link; Case: XTAL_32.768; ComponentLink2Description: Datasheet; Published: 18.08.2010; Publisher: ppavlov
Y2 = Crystall_25Mhz: Low profile Xtal through hole; Frequency stability: 50 ppm; Pb Free: Yes; Value: 25Mhz; Part Number: Crystall_25Mhz; Temperature: -20 - +70 C; Component Type: Standard; ComponentLink1Description: Manufacturer Link; Case: CRYSTAL200; ComponentLink2Description: Datasheet; Published: 18.08.2010; Publisher: ppavlov
Y3 = Crystall_8Mhz: Low profile Xtal through hole; Frequency stability: 50 ppm; Pb Free: Yes; Value: 8Mhz; Part Number: Crystall_8Mhz; Temperature: -20 - +70 C; Component Type: Standard; ComponentLink1Description: Manufacturer Link; Case: CRYSTAL200; ComponentLink2Description: Datasheet; Published: 18.08.2010; Publisher: ppavlov